# EAGLE design resolver (EAGLE 9.2.2)
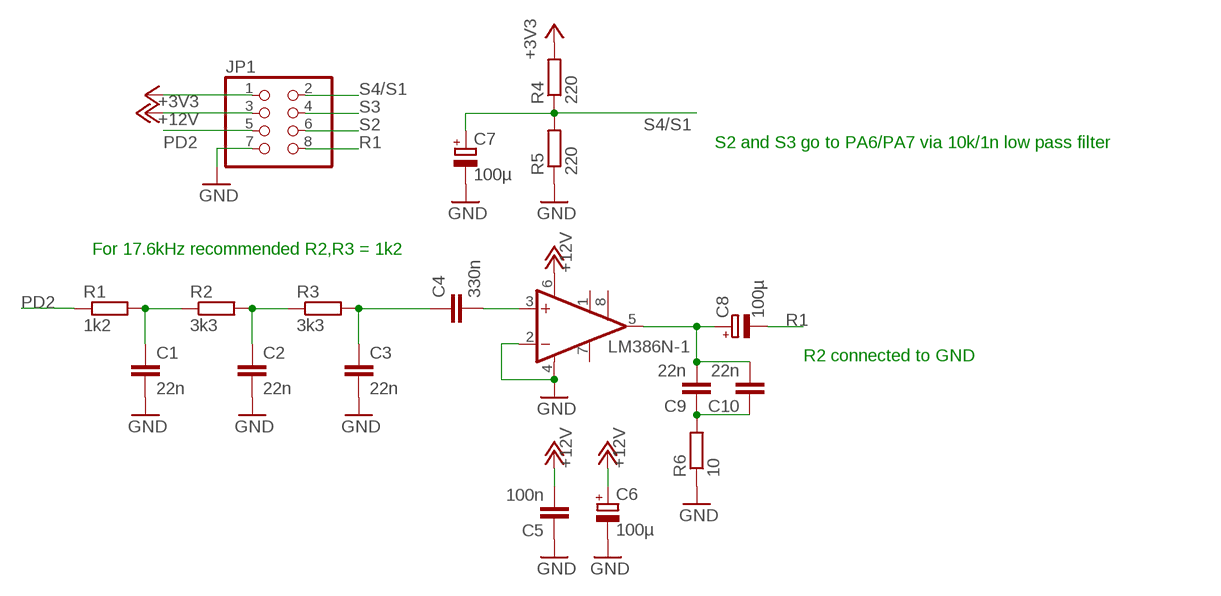
[diagram p0: schematic, sheet 1]

## Parts
C1  22n  C-EU050-024X044  [C050-024X044]
C2  22n  C-EU050-024X044  [C050-024X044]
C3  22n  C-EU050-024X044  [C050-024X044]
C4  330n  C-EU025-024X044  [C025-024X044]
C5  100n  C-EU025-024X044  [C025-024X044]
C6  100µ  CPOL-EUE2,5-6E  [E2,5-6E]
C7  100µ  CPOL-EUE2,5-6E  [E2,5-6E]
C8  100µ  CPOL-EUE2,5-6E  [E2,5-6E]
C9  22n  C-EU050-024X044  [C050-024X044]
C10  22n  C-EU050-024X044  [C050-024X044]
IC1  LM386N-1  [DIL08]
JP1  PINHD-2X4  [2X04]
R1  1k2  R-EU_0204/2V  [0204V]
R2  3k3  R-EU_0204/2V  [0204V]
R3  3k3  R-EU_0204/2V  [0204V]
R4  220  R-EU_0207/10  [0207/10]
R5  220  R-EU_0204/2V  [0204V]
R6  10  R-EU_0204/2V  [0204V]

## Nets
+3V3: JP1.1 R4.2
+12V: C5.2 C6.+ IC1.6(VS) JP1.3
GND: C1.2 C2.2 C3.2 C5.1 C6.- C7.- IC1.2(-IN) IC1.4(GND) JP1.7 R5.1 R6.1
N$1: C8.+ C9.2 C10.2 IC1.5(OUT)
N$2: C3.1 C4.1 R3.2
N$3: C4.2 IC1.3(+IN)
N$4: C1.1 R1.2 R2.1
N$5: C2.1 R2.2 R3.1
N$6: C9.1 C10.1 R6.2
PD2: JP1.5 R1.1
R1: C8.- JP1.8
S2: JP1.6
S3: JP1.4
S4/S1: C7.+ JP1.2 R4.1 R5.2
Unconnected: IC1.1(GAIN) IC1.7(BYPASS) IC1.8(GAIN)

## Notes on the sheet
- S2 and S3 go to PA6/PA7 via 10k/1n low pass filter
- For 17.6kHz recommended R2,R3 = 1k2
- R2 connected to GND

## Library data of the parts
C1-C5 C9 C10 = rcl:C-EU: CAPACITOR, European symbol; SPICEPREFIX: C
C6-C8 = rcl:CPOL-EU: POLARIZED CAPACITOR, European symbol; SPICEPREFIX: C
IC1 = linear:LM386?-*: Low Voltage Audio Power Amplifier Source: http://cache.national.com/ds/LM/LM386.pdf
JP1 = pinhead:PINHD-2X4: PIN HEADER
R1-R6 = rcl:R-EU_: RESISTOR, European symbol; SPICEPREFIX: R

## Board
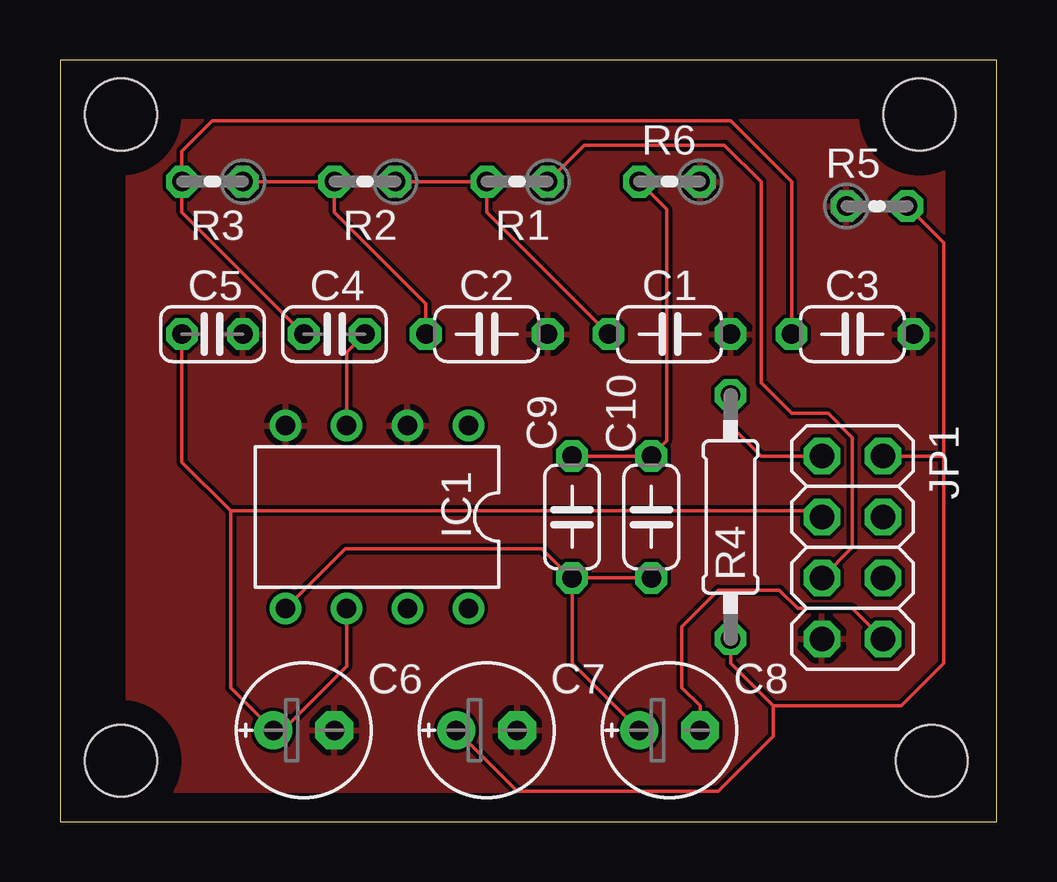
[diagram p1: board, top side]
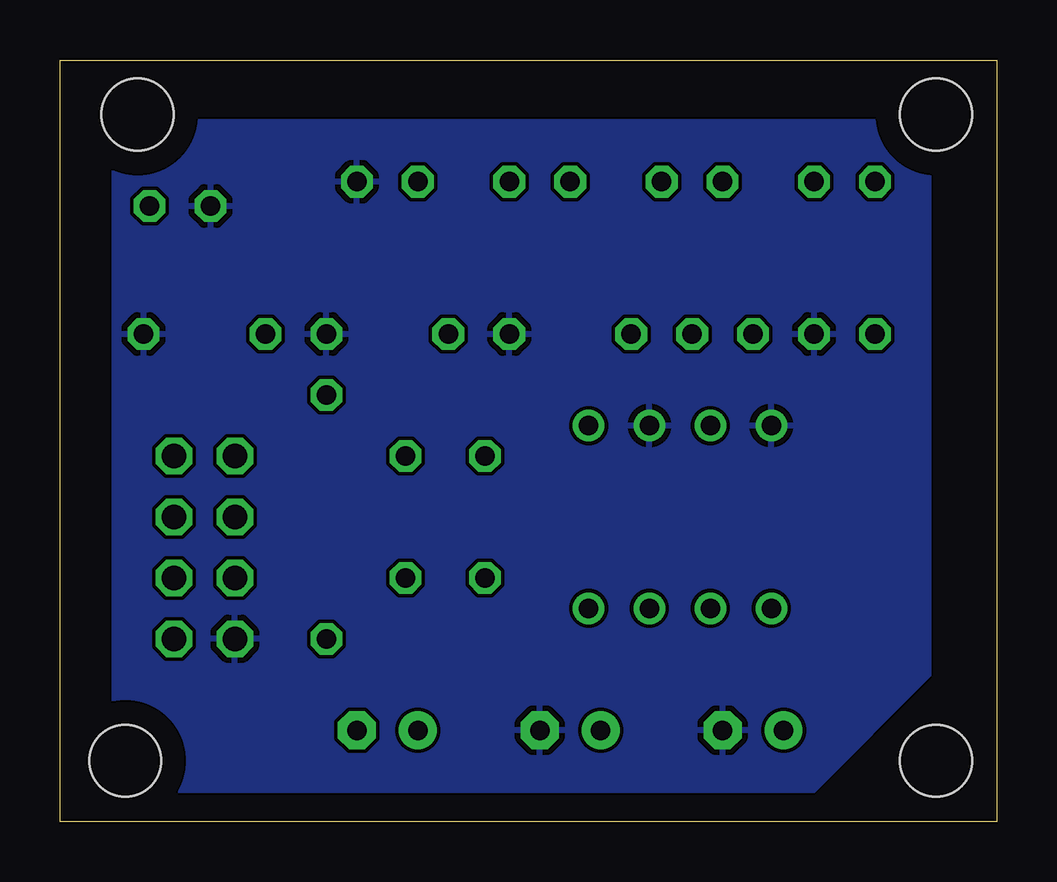
[diagram p2: board, bottom side, seen from below]

Size 39.04 x 31.74 mm. Coordinates in mm from the lower left corner, seen from the top.
Outline: 0,0 39.04,0 39.04,31.74 0,31.74 0,0
Copper layers (1*16): Top 0.035mm / dielectric 1.5mm / Bottom 0.035mm
Design rules "default": minimum track width 6mil, minimum drill 0.35mm, track to track 6mil, track to pad 6mil, pad to pad 6mil, via to via 6mil, smd to smd 6mil, copper to edge 40mil, drill to drill 6mil, minimum pad ring 10mil, minimum via ring 8mil, stop-mask expansion 4mil, vias tented up to drill 0mil, thermal gap 10mil
Holes 3 mm at 2.54,29.46 35.81,29.46 36.32,2.54 2.54,2.54

### Footprints (pad centres in the part's own frame; a part is rotated, then mirrored left to right if it is on the bottom)
C050-024X044 = drill 0.813 octagon: 1 -2.54,0; 2 2.54,0
C025-024X044 = drill 0.813 octagon: 1 -1.27,0; 2 1.27,0
E2,5-6E = drill 0.813 pad 1.575: + -1.27,0 | drill 0.813 pad 1.575 octagon: - 1.27,0
DIL08 = drill 0.813 pad 1.27: 1 -3.81,-3.81; 2 -1.27,-3.81; 3 1.27,-3.81; 4 3.81,-3.81; 5 3.81,3.81; 6 1.27,3.81; 7 -1.27,3.81; 8 -3.81,3.81
2X04 = drill 1.016 octagon: 1 -3.81,-1.27; 2 -3.81,1.27; 3 -1.27,-1.27; 4 -1.27,1.27; 5 1.27,-1.27; 6 1.27,1.27; 7 3.81,-1.27; 8 3.81,1.27
0204V = drill 0.813 octagon: 1 -1.27,0; 2 1.27,0
0207/10 = drill 0.813 octagon: 1 -5.08,0; 2 5.08,0

### Placement (x,y rotation side)
C1  25.4,20.32 0 top
C2  17.78,20.32 0 top
C3  33.02,20.32 0 top
C4  11.43,20.32 0 top
C5  6.35,20.32 180 top
C6  10.16,3.81 0 top
C7  17.78,3.81 0 top
C8  25.4,3.81 0 top
C9  21.34,12.7 270 top
C10  24.64,12.7 270 top
IC1  13.21,12.7 180 top
JP1  33.02,11.43 270 top
R1  19.05,26.67 180 top
R2  12.7,26.67 180 top
R3  6.35,26.67 180 top
R4  27.94,12.7 90 top
R5  34.04,25.65 0 top
R6  25.4,26.67 180 top

### Tracks (layer width: path | path; a pad name or v marks a point on that pad's centre or on a via)
+3V3
  Top 0.152: R4.2 27.94,16.51 29.21,15.24 JP1.1
+12V
  Top 0.152: IC1.6 11.94,6.48 9.27,3.81 C6.+ 7.11,5.59 7.11,12.95 | 7.11,12.95 5.08,14.99 C5.2 | JP1.3 31.5,12.95 7.11,12.95
GND
  pour Bottom: 2.79,29.21 36.83,29.21 36.83,1.27 7.62,1.27 2.79,6.1
  pour Top: 2.79,29.21 2.79,1.27 36.83,1.27 36.83,29.21
N$1
  Top 0.152: IC1.5 11.88,11.37 20.07,11.37 21.28,10.16 C9.2 | C8.+ 21.34,6.6 C9.2 | C9.2 C10.2
N$2
  Top 0.152: C3.1 30.48,26.67 27.94,29.21 6.35,29.21 5.08,27.94 R3.2 5.08,25.4 C4.1
N$3
  Top 0.152: C4.2 11.94,19.56 IC1.3
N$4
  Top 0.152: R2.1 R1.2 17.78,25.4 C1.1
N$5
  Top 0.152: R3.1 R2.2 11.43,25.4 15.24,21.59 C2.1
N$6
  Top 0.152: R6.2 25.27,25.53 25.27,15.88 C10.1 C9.1
PD2
  Top 0.152: R1.1 21.84,28.19 27.69,28.19 29.21,26.67 29.21,18.29 30.48,17.02 32,17.02 33.02,16 33.02,11.43 JP1.5
R1
  Top 0.152: JP1.8 33.02,8.89 30.73,8.89 29.97,9.65 27.43,9.65 25.91,8.13 25.91,5.59 26.67,4.83 C8.-
S4/S1
  Top 0.152: 29.72,4.83 27.94,6.6 R4.1 | C7.+ 19.05,1.27 27.43,1.27 29.72,3.56 29.72,4.83 | 36.83,15.24 36.83,6.6 35.05,4.83 29.72,4.83 | 36.83,15.24 36.83,24.13 R5.2 | 36.83,15.24 JP1.2